# Altium schematic sheet DRIVE_MOTORS.SchDoc
size A; SheetNumber: 5; SheetTotal: 6
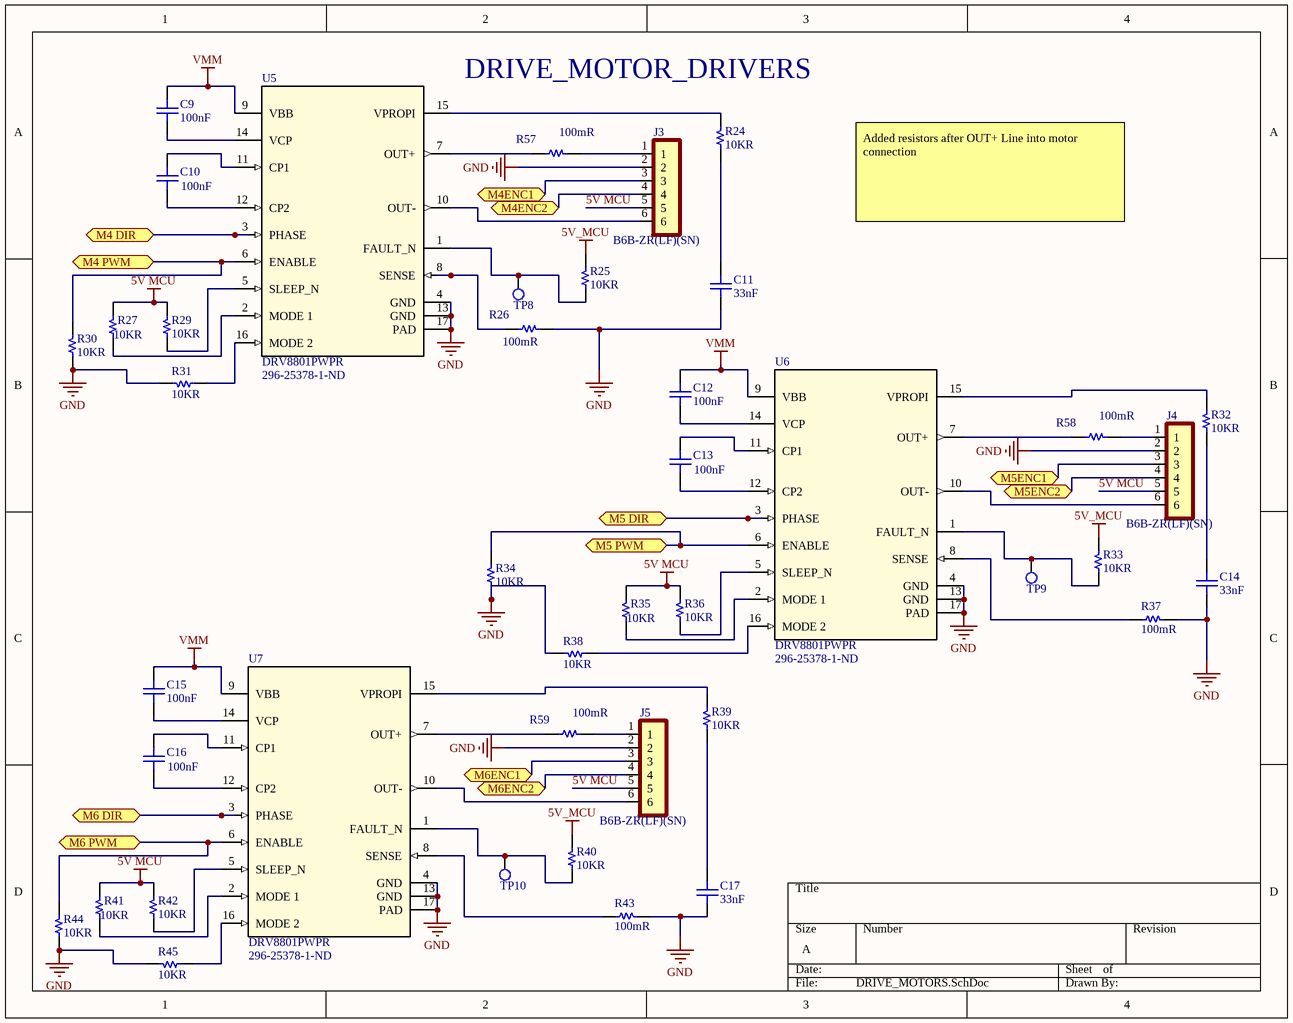
[diagram p0: DRIVE_MOTORS.SchDoc]

## Parts
C9  100nF  [CAP_ADJ_0805]
C10  100nF  [CAP_ADJ_0805]
C11  33nF  [CAP_ADJ_0805]
C12  100nF  [CAP_ADJ_0805]
C13  100nF  [CAP_ADJ_0805]
C14  33nF  [CAP_ADJ_0805]
C15  100nF  [CAP_ADJ_0805]
C16  100nF  [CAP_ADJ_0805]
C17  33nF  [CAP_ADJ_0805]
J3  B6B-ZR(LF)(SN)  [JST_B6B-ZR(LF)(SN)]
J4  B6B-ZR(LF)(SN)  [JST_B6B-ZR(LF)(SN)]
J5  B6B-ZR(LF)(SN)  [JST_B6B-ZR(LF)(SN)]
R24  10KR  [RES_ADJ_0805_YAGEO]
R25  10KR  [RES_ADJ_0805_YAGEO]
R26  100mR  [RES_ADJ_0805_YAGEO]
R27  10KR  [RES_ADJ_0805_YAGEO]
R29  10KR  [RES_ADJ_0805_YAGEO]
R30  10KR  [RES_ADJ_0805_YAGEO]
R31  10KR  [RES_ADJ_0805_YAGEO]
R32  10KR  [RES_ADJ_0805_YAGEO]
R33  10KR  [RES_ADJ_0805_YAGEO]
R34  10KR  [RES_ADJ_0805_YAGEO]
R35  10KR  [RES_ADJ_0805_YAGEO]
R36  10KR  [RES_ADJ_0805_YAGEO]
R37  100mR  [RES_ADJ_0805_YAGEO]
R38  10KR  [RES_ADJ_0805_YAGEO]
R39  10KR  [RES_ADJ_0805_YAGEO]
R40  10KR  [RES_ADJ_0805_YAGEO]
R41  10KR  [RES_ADJ_0805_YAGEO]
R42  10KR  [RES_ADJ_0805_YAGEO]
R43  100mR  [RES_ADJ_0805_YAGEO]
R44  10KR  [RES_ADJ_0805_YAGEO]
R45  10KR  [RES_ADJ_0805_YAGEO]
R57  100mR  [RES_ADJ_0805_YAGEO]
R58  100mR  [RES_ADJ_0805_YAGEO]
R59  100mR  [RES_ADJ_0805_YAGEO]
TP8  TEST_POINT  [TEST_POINT]  (value not drawn)
TP9  TEST_POINT  [TEST_POINT]  (value not drawn)
TP10  TEST_POINT  [TEST_POINT]  (value not drawn)
U5  DRV8801PWPR  Supplier Part Number 1: 296-25378-1-ND  [PWP0016B_N]
U6  DRV8801PWPR  Supplier Part Number 1: 296-25378-1-ND  [PWP0016B_N]
U7  DRV8801PWPR  Supplier Part Number 1: 296-25378-1-ND  [PWP0016B_N]

## Ports
M4 DIR (bidir), M4 PWM (bidir), M4ENC1 (bidir), M4ENC2 (bidir), M5 DIR (bidir), M5 PWM (bidir), M5ENC1 (bidir), M5ENC2 (bidir), M6 DIR (bidir), M6 PWM (bidir), M6ENC1 (bidir), M6ENC2 (bidir)

## Nets
5V MCU: J3.5 J4.5 J5.5 R27.2 R29.2 R35.2 R36.2 R41.2 R42.2
5V_MCU: R25.2 R33.2 R40.2
GND: C11.1 C14.1 C17.1 J3.2 J4.2 J5.2 R26.2 R30.1 R31.2 R34.1 R37.2 R38.2 R43.2 R44.1 R45.2 U5.4(GND) U5.13(GND) U5.17(PAD) U6.4(GND) U6.13(GND) U6.17(PAD) U7.4(GND) U7.13(GND) U7.17(PAD)
VMM: C9.2 C12.2 C15.2 U5.9(VBB) U6.9(VBB) U7.9(VBB)
M4 DIR: U5.3(PHASE) ; port M4 DIR
M4 PWM: R30.2 U5.6(ENABLE) ; port M4 PWM
M4ENC1: J3.3 ; port M4ENC1
M4ENC2: J3.4 ; port M4ENC2
M5 DIR: U6.3(PHASE) ; port M5 DIR
M5 PWM: R34.2 U6.6(ENABLE) ; port M5 PWM
M5ENC1: J4.3 ; port M5ENC1
M5ENC2: J4.4 ; port M5ENC2
M6 DIR: U7.3(PHASE) ; port M6 DIR
M6 PWM: R44.2 U7.6(ENABLE) ; port M6 PWM
M6ENC1: J5.3 ; port M6ENC1
M6ENC2: J5.4 ; port M6ENC2
NetC9_1: C9.1 U5.14(VCP)
NetC10_1: C10.1 U5.12(CP2)
NetC10_2: C10.2 U5.11(CP1)
NetC11_2: C11.2 R24.1
NetC12_1: C12.1 U6.14(VCP)
NetC13_1: C13.1 U6.12(CP2)
NetC13_2: C13.2 U6.11(CP1)
NetC14_2: C14.2 R32.1
NetC15_1: C15.1 U7.14(VCP)
NetC16_1: C16.1 U7.12(CP2)
NetC16_2: C16.2 U7.11(CP1)
NetC17_2: C17.2 R39.1
NetJ3_1: J3.1 R57.2
NetJ3_6: J3.6 U5.10(OUT-)
NetJ4_1: J4.1 R58.2
NetJ4_6: J4.6 U6.10(OUT-)
NetJ5_1: J5.1 R59.2
NetJ5_6: J5.6 U7.10(OUT-)
NetR24_2: R24.2 U5.15(VPROPI)
NetR25_1: R25.1 TP8.1 U5.1(FAULT_N)
NetR26_1: R26.1 U5.8(SENSE)
NetR27_1: R27.1 U5.2(MODE_1)
NetR29_1: R29.1 U5.5(SLEEP_N)
NetR31_1: R31.1 U5.16(MODE_2)
NetR32_2: R32.2 U6.15(VPROPI)
NetR33_1: R33.1 TP9.1 U6.1(FAULT_N)
NetR35_1: R35.1 U6.2(MODE_1)
NetR36_1: R36.1 U6.5(SLEEP_N)
NetR37_1: R37.1 U6.8(SENSE)
NetR38_1: R38.1 U6.16(MODE_2)
NetR39_2: R39.2 U7.15(VPROPI)
NetR40_1: R40.1 TP10.1 U7.1(FAULT_N)
NetR41_1: R41.1 U7.2(MODE_1)
NetR42_1: R42.1 U7.5(SLEEP_N)
NetR43_1: R43.1 U7.8(SENSE)
NetR45_1: R45.1 U7.16(MODE_2)
NetR57_1: R57.1 U5.7(OUT+)
NetR58_1: R58.1 U6.7(OUT+)
NetR59_1: R59.1 U7.7(OUT+)

## Notes on the sheet
- DRIVE_MOTOR_DRIVERS
- Added resistors after OUT+ Line into motor connection

## Library data of the parts
C9 C10 C12 C13 C15 C16 = CAP_ADJ_0805: CERAMIC CAPACITOR SMD 0805; Manufacturer: KEMET; Manufacturer Part Number: C0805C104J5RACAUTO; Voltage Rating: 50V; Tolerance: 5%; Dielectric: X7R; Supplier 1: Digi-Key; Supplier Part Number 1: 399-6925-1-ND; Stock 1: 9661; Pricing 1: 1=0.22, 10=0.152, 100=0.0769, 500=0.0526, 1000=0.0466 (USD); Mount: Surface Mount; Case/Package: 0805; Case Code (Metric): 2012; Case Code (Imperial): 0805; Dielectric Material: Ceramic; Min Operating Temperature: -55°C; Max Operating Temperature: 125°C; Package Quantity: 1; Capacitance: 100nF; Packaging: Cut Tape; Voltage Rating (DC): 50V; Length: 0.079inch; Width: 0.049inch; Thickness: 0.035inch; Depth: 1.25mm; REACH SVHC: No SVHC; ComponentLink1URL: http://components.arrow.com/part/dataview/0323_00324161; ComponentLink1Description: http://components.arrow.com/part/dataview/0323_00324161; ComponentLink2URL: http://www.farnell.com/datasheets/2123421.pdf; ComponentLink2Description: http://www.farnell.com/datasheets/2123421.pdf; ComponentLink3URL: https://search.kemet.com/component-edge/download/datasheet/C0805C104J5RACAUTO.pdf; ComponentLink3Description: https://search.kemet.com/component-edge/download/datasheet/C0805C104J5RACAUTO.pdf
C11 C14 C17 = CAP_ADJ_0805: CERAMIC CAPACITOR SMD 0805; Manufacturer: Samsung; Manufacturer Part Number: CL21B333JBANNNC; Tolerance: 5%; Voltage Rating: 50V; Dielectric: X7R; Supplier 1: Digi-Key; Supplier Part Number 1: 1276-2505-1-ND; Stock 1: 12525; Pricing 1: 1=0.21, 10=0.151, 100=0.0711, 500=0.0499, 1000=0.0413 (USD); Mount: Surface Mount; Case/Package: 0805; Case Code (Metric): 2012; Case Code (Imperial): 0805; Min Operating Temperature: -55°C; Max Operating Temperature: 125°C; Capacitance: 33nF; Packaging: Tape and Reel; Package Quantity: 1; Voltage: 50V; Voltage Rating (DC): 50V; Length: 2mm; Height: 0.65mm; Width: 0.049inch; Thickness: 0.03inch; Depth: 1.25mm; Radiation Hardening: No; ComponentLink1URL: https://datasheet.ciiva.com/26838/getdatasheetpartid-356482-26838724.pdf; ComponentLink1Description: https://datasheet.ciiva.com/26838/getdatasheetpartid-356482-26838724.pdf; ComponentLink2URL: https://datasheet.ciiva.com/25728/cl21b333jbannnc-25728473.pdf; ComponentLink2Description: https://datasheet.ciiva.com/25728/cl21b333jbannnc-25728473.pdf
J3-J5 = B6B-ZR(LF)(SN): Connector Header Through Hole 6 position 0.059 _1.50mm_; MF: JST Sales; MP: B6B-ZR_LF__SN_; Package: None; Price: None; SnapEDA_Link: https://www.snapeda.com/parts/B6B-ZR%28LF%29%28SN%29/JST%20Sales%20America%20Inc./view-part/279441/?ref=snap; Availability: Unavailable; Value: *
R24 R25 R27 R29-R36 R38-R42 R44 R45 = RES_ADJ_0805: RESISTOR 0805 YAGEO; Manufacturer Part Number: RC0805JR-0710KL; Tolerance: 5%; Temperature Coefficient: 100ppm/°C; Power Rating: 125mW; Voltage Rating: 150V; Value: *; Supplier 1: Digi-Key; Supplier Part Number 1: 311-10KARDKR-ND; Manufacturer: Yageo; Stock 1: 1589050; Pricing 1: 1=0.1, 10=0.019, 100=0.0076, 1000=0.0034, 2500=0.003 (USD); Case/Package: 0805; Contact Plating: Tin,Matte; Case Code (Imperial): 0805; Case Code (Metric): 2012; Min Operating Temperature: -55°C; Max Operating Temperature: 155°C; Resistance: 10KR; Packaging: Tape and Reel; Composition: Thick Film; Termination: SMD/SMT; Military Standard: Not; Length: 2mm; Height: 0.5mm; Width: 1.25mm; Depth: 1.25mm; Radiation Hardening: No; REACH SVHC: Unknown; Lead Free: Lead Free; ComponentLink1URL: https://datasheet.ciiva.com/7983/444164-7983765.pdf; ComponentLink1Description: https://datasheet.ciiva.com/7983/444164-7983765.pdf; ComponentLink2URL: https://datasheet.ciiva.com/7941/444164-7941870.pdf; ComponentLink2Description: https://datasheet.ciiva.com/7941/444164-7941870.pdf; ComponentLink3URL: https://datasheet.ciiva.com/7941/444164-7941871.pdf; ComponentLink3Description: https://datasheet.ciiva.com/7941/444164-7941871.pdf
R26 R37 R43 R57-R59 = RES_ADJ_0805: RESISTOR 0805 YAGEO; Manufacturer: Panasonic; Manufacturer Part Number: ERJ-6DSFR10V; Tolerance: 1%; Max Power Dissipation: 500mW; Temperature Coefficient: 150ppm/°C; Supplier 1: Digi-Key; Supplier Part Number 1: P19308CT-ND; Stock 1: 16904; Pricing 1: 1=0.5, 10=0.36, 25=0.266, 50=0.196, 100=0.1438, 250=0.1188, 500=0.098, 1000=0.0709 (USD); Case/Package: 0805; Case Code (Metric): 2012; Case Code (Imperial): 0805; Min Operating Temperature: -55°C; Max Operating Temperature: 155°C; Packaging: Cut Tape; Resistance: 100mR; Composition: Thick Film; Number of Terminations: 2; Length: 0.079inch; Height: 0.028inch; Width: 0.049inch; ComponentLink1URL: https://industrial.panasonic.com/cdbs/www-data/pdf/RDN0000/AOA0000C313.pdf; ComponentLink1Description: https://industrial.panasonic.com/cdbs/www-data/pdf/RDN0000/AOA0000C313.pdf
TP8-TP10 = TEST_POINT: TEST POINT PAD
U5-U7 = DRV8801PWPR: IC MOTOR DRIVER PAR 16HTSSOP; Manufacturer: Texas Instruments; Max Supply Voltage: 38V; Min Supply Voltage: 8V; Output Current: 2.8A; Nominal Supply Current: 6mA; Logic Function: AND; Quiescent Current: 3.2mA; Operating Supply Voltage: 36V; Number of Outputs: 1; Interface: Parallel; Supplier 1: Digi-Key; Manufacturer Part Number: DRV8801PWPR; Stock 1: 45192; Pricing 1: 1=2.65, 10=2.377, 100=1.9109, 500=1.57, 1000=1.3008 (USD); Mount: Surface Mount; Case/Package: HTSSOP EP; Number of Pins: 16; Weight: 0.002212oz; Min Operating Temperature: -40°C; Max Operating Temperature: 85°C; Packaging: Tape and Reel; Package Quantity: 2000; Radiation Hardening: No; Lead Free: Lead Free; REACH SVHC: No SVHC; ComponentLink1URL: https://datasheet.ciiva.com/1958/drv8801-1958736.pdf; ComponentLink1Description: https://datasheet.ciiva.com/1958/drv8801-1958736.pdf; ComponentLink2URL: https://datasheet.ciiva.com/1958/drv8801-1958737.pdf; ComponentLink2Description: https://datasheet.ciiva.com/1958/drv8801-1958737.pdf; ComponentLink3URL: https://datasheet.ciiva.com/15109/getdatasheetpartid-362071-15109493.pdf; ComponentLink3Description: https://datasheet.ciiva.com/15109/getdatasheetpartid-362071-15109493.pdf; ComponentLink4URL: https://datasheet.ciiva.com/26086/drv8801-26086021.pdf; ComponentLink4Description: https://datasheet.ciiva.com/26086/drv8801-26086021.pdf; ComponentLink5URL: https://datasheet.ciiva.com/3229/drv8801-3229006.pdf; ComponentLink5Description: https://datasheet.ciiva.com/3229/drv8801-3229006.pdf; ComponentLink6URL: https://datasheet.ciiva.com/1958/drv8801-1958735.pdf; ComponentLink6Description: https://datasheet.ciiva.com/1958/drv8801-1958735.pdf; ComponentLink7URL: https://datasheet.ciiva.com/41457/001013558-da-01-en-ic-motor-driver-drv8801pwpr-tssop-16-tid-41457316.pdf; ComponentLink7Description: https://datasheet.ciiva.com/41457/001013558-da-01-en-ic-motor-driver-drv8801pwpr-tssop-16-tid-41457316.pdf